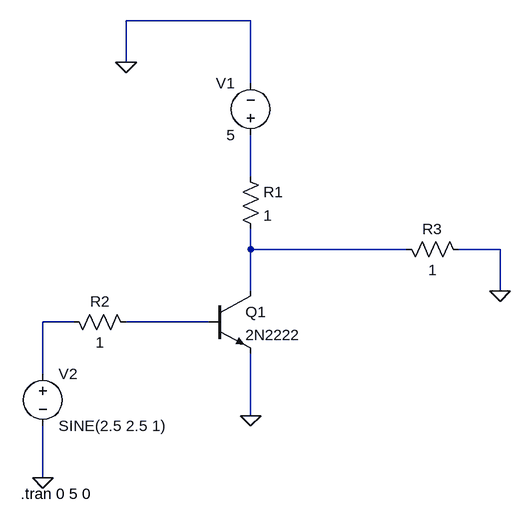
[diagram p0: schematic BJT Test.asc]
BJT Test.asc, the LTspice schematic file:
Version 4
SHEET 1 880 680
WIRE 0 -304 -192 -304
WIRE -192 -240 -192 -304
WIRE 0 -208 0 -304
WIRE 0 -64 0 -128
WIRE 0 48 0 16
WIRE 240 48 0 48
WIRE 384 48 320 48
WIRE 0 112 0 48
WIRE 384 112 384 48
WIRE -272 160 -320 160
WIRE -64 160 -192 160
WIRE -320 240 -320 160
WIRE 0 304 0 208
WIRE -320 400 -320 320
FLAG -192 -240 0
FLAG 0 304 0
FLAG -320 400 0
FLAG 384 112 0
SYMBOL voltage 0 -112 R180
WINDOW 0 24 96 Left 2
WINDOW 3 24 16 Left 2
SYMATTR InstName V1
SYMATTR Value 5
SYMBOL res -16 -80 R0
SYMATTR InstName R1
SYMATTR Value 1
SYMBOL npn -64 112 R0
SYMATTR InstName Q1
SYMATTR Value 2N2222
SYMBOL voltage -320 224 R0
WINDOW 123 0 0 Left 0
WINDOW 39 0 0 Left 0
SYMATTR InstName V2
SYMATTR Value SINE(2.5 2.5 1)
SYMBOL res -288 144 M90
WINDOW 0 0 56 VBottom 2
WINDOW 3 32 56 VTop 2
SYMATTR InstName R2
SYMATTR Value 1
SYMBOL res 224 32 M90
WINDOW 0 0 56 VBottom 2
WINDOW 3 32 56 VTop 2
SYMATTR InstName R3
SYMATTR Value 1
TEXT -354 424 Left 2 !.tran 0 5 0

The netlist it stands for:
* BJT Test.asc
V1 N001 0 5
R1 N001 N002 1
Q1 N002 N004 0 0 2N2222
V2 N003 0 SINE(2.5 2.5 1)
R2 N003 N004 1
R3 N002 0 1
.model NPN NPN
.model PNP PNP
.lib standard.bjt
.tran 0 5 0
.backanno
.end